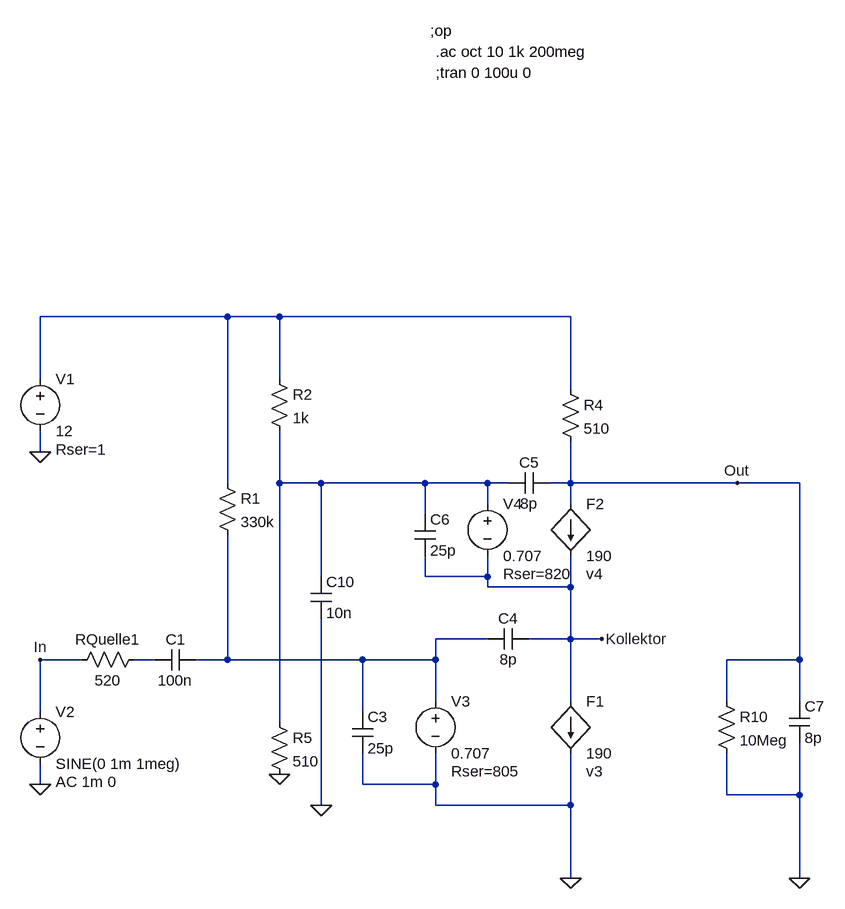
[diagram p0: schematic Draft3.asc]
Draft3.asc, the LTspice schematic file:
Version 4
SHEET 1 880 724
WIRE -160 -160 -448 -160
WIRE -80 -160 -160 -160
WIRE 368 -160 -80 -160
WIRE -448 -64 -448 -160
WIRE -80 -64 -80 -160
WIRE 368 -48 368 -160
WIRE -448 48 -448 16
WIRE -160 96 -160 -160
WIRE -80 96 -80 16
WIRE -16 96 -80 96
WIRE 144 96 -16 96
WIRE 240 96 144 96
WIRE 272 96 240 96
WIRE 368 96 368 32
WIRE 368 96 336 96
WIRE 624 96 368 96
WIRE 720 96 624 96
WIRE 240 128 240 96
WIRE 368 128 368 96
WIRE 144 144 144 96
WIRE -16 240 -16 96
WIRE 144 240 144 208
WIRE 240 240 240 208
WIRE 240 240 144 240
WIRE 240 256 240 240
WIRE 368 256 368 208
WIRE 368 256 240 256
WIRE 240 336 160 336
WIRE 368 336 368 256
WIRE 368 336 304 336
WIRE 416 336 368 336
WIRE -384 368 -448 368
WIRE -272 368 -304 368
WIRE -160 368 -160 176
WIRE -160 368 -208 368
WIRE 48 368 -160 368
WIRE 160 368 160 336
WIRE 160 368 48 368
WIRE 720 368 720 96
WIRE 720 368 608 368
WIRE 160 432 160 368
WIRE 368 432 368 336
WIRE 608 432 608 368
WIRE 720 432 720 368
WIRE -448 448 -448 368
WIRE 48 448 48 368
WIRE -80 464 -80 96
WIRE -448 560 -448 528
WIRE 48 560 48 512
WIRE 160 560 160 512
WIRE 160 560 48 560
WIRE 608 576 608 512
WIRE 720 576 720 496
WIRE 720 576 608 576
WIRE -16 592 -16 304
WIRE 160 592 160 560
WIRE 368 592 368 512
WIRE 368 592 160 592
WIRE 368 704 368 592
WIRE 720 704 720 576
FLAG -448 560 0
FLAG -448 48 0
FLAG 368 704 0
FLAG 720 704 0
FLAG -448 368 In
FLAG -80 544 0
FLAG -16 592 0
FLAG 416 336 Kollektor
FLAG 624 96 Out
SYMBOL voltage -448 -80 R0
WINDOW 123 0 0 Left 0
WINDOW 39 24 124 Left 2
SYMATTR InstName V1
SYMATTR Value 12
SYMATTR SpiceLine Rser=1
SYMBOL voltage -448 432 R0
WINDOW 123 24 124 Left 2
WINDOW 39 0 0 Left 0
SYMATTR InstName V2
SYMATTR Value SINE(0 1m 1meg)
SYMATTR Value2 AC 1m 0
SYMBOL voltage 160 416 R0
WINDOW 123 0 0 Left 0
WINDOW 39 24 124 Left 2
SYMATTR InstName V3
SYMATTR Value 0.707
SYMATTR SpiceLine Rser=805
SYMBOL f 368 432 R0
WINDOW 38 24 108 Left 2
SYMATTR InstName F1
SYMATTR Value 190
SYMATTR SpiceModel v3
SYMBOL cap -208 352 R90
WINDOW 0 0 32 VBottom 2
WINDOW 3 32 32 VTop 2
SYMATTR InstName C1
SYMATTR Value 100n
SYMBOL res -176 80 R0
SYMATTR InstName R1
SYMATTR Value 330k
SYMBOL res 352 -64 R0
SYMATTR InstName R4
SYMATTR Value 510
SYMBOL res 592 416 R0
SYMATTR InstName R10
SYMATTR Value 10Meg
SYMBOL cap 704 432 R0
SYMATTR InstName C7
SYMATTR Value 8p
SYMBOL cap 32 448 R0
SYMATTR InstName C3
SYMATTR Value 25p
SYMBOL cap 304 320 R90
WINDOW 0 0 32 VBottom 2
WINDOW 3 32 32 VTop 2
SYMATTR InstName C4
SYMATTR Value 8p
SYMBOL res -288 352 R90
WINDOW 0 0 56 VBottom 2
WINDOW 3 32 56 VTop 2
SYMATTR InstName RQuelle1
SYMATTR Value 520
SYMBOL res -96 -80 R0
SYMATTR InstName R2
SYMATTR Value 1k
SYMBOL res -96 448 R0
SYMATTR InstName R5
SYMATTR Value 510
SYMBOL cap 336 80 R90
WINDOW 0 0 32 VBottom 2
WINDOW 3 32 32 VTop 2
SYMATTR InstName C5
SYMATTR Value 8p
SYMBOL voltage 240 112 R0
WINDOW 123 0 0 Left 0
WINDOW 39 24 124 Left 2
SYMATTR InstName V4
SYMATTR Value 0.707
SYMATTR SpiceLine Rser=820
SYMBOL cap 128 144 R0
SYMATTR InstName C6
SYMATTR Value 25p
SYMBOL f 368 128 R0
WINDOW 38 24 108 Left 2
SYMATTR InstName F2
SYMATTR Value 190
SYMATTR SpiceModel v4
SYMBOL cap -32 240 R0
SYMATTR InstName C10
SYMATTR Value 10n
TEXT 152 -600 Left 2 !;op
TEXT 160 -568 Left 2 !.ac oct 10 1k 200meg
TEXT 160 -536 Left 2 !;tran 0 100u 0

The netlist it stands for:
* Draft3.asc
V1 N001 0 12 Rser=1
V2 In 0 SINE(0 1m 1meg) AC 1m 0
V3 N003 0 0.707 Rser=805
F1 Kollektor 0 v3 190
C1 N003 N004 100n
R1 N001 N003 330k
R4 N001 Out 510
R10 Out 0 10Meg
C7 Out 0 8p
C3 N003 0 25p
C4 Kollektor N003 8p
RQuelle1 N004 In 520
R2 N001 N002 1k
R5 N002 0 510
C5 Out N002 8p
V4 N002 Kollektor 0.707 Rser=820
C6 N002 Kollektor 25p
F2 Out Kollektor v4 190
C10 N002 0 10n
;op
.ac oct 10 1k 200meg
;tran 0 100u 0
.backanno
.end